# Altium schematic sheet PIC.SchDoc
size A
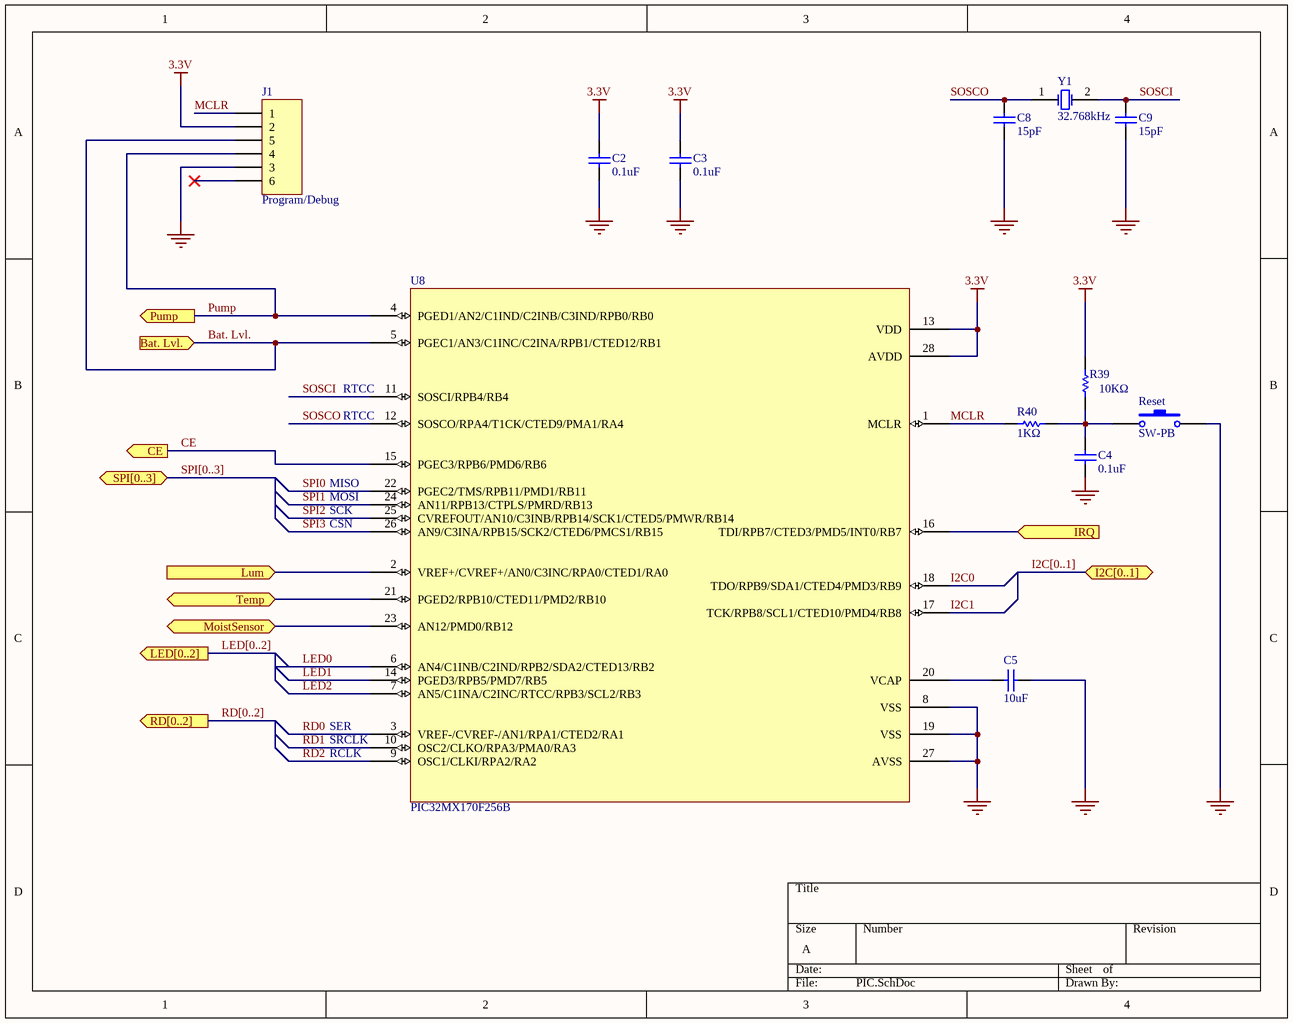
[diagram p0: PIC.SchDoc]

## Parts
C2  0.1uF  [C0603]
C3  0.1uF  [C0603]
C4  0.1uF  [C0603]
C5  10uF  [C0603]
C8  15pF  [C0603]
C9  15pF  [C0603]
J1  Program/Debug  [HDR1X6]
R39  10KΩ  [R0603]
R40  1KΩ  [R0603]
Reset  SW-PB  [Reset]
U8  PIC32MX170F256B  [PIC32MX170F256B]
Y1  32.768kHz  [XTAL]

## Ports
Bat. Lvl. (in), CE (out), I2C[0..1] (bidir), IRQ (in), LED[0..2] (out), Lum (in), MoistSensor (bidir), Pump (out), RD[0..2] (out), SPI[0..3] (bidir), Temp (bidir)

## Nets
3.3V: C2.2 C3.2 J1.2 R39.2 U8.13(VDD) U8.28(AVDD)
GND: C2.1 C3.1 C4.1 C5.2 C8.1 C9.1 J1.3 Reset.2 U8.8(VSS) U8.19(VSS) U8.27(AVSS)
Bat. Lvl.: J1.5 U8.5(PGEC1/AN3/C1INC/C2INA/RPB1/CTED12/RB1) ; port Bat. Lvl.
CE: U8.15(PGEC3/RPB6/PMD6/RB6) ; port CE
I2C0: U8.18(TDO/RPB9/SDA1/CTED4/PMD3/RB9)
I2C1: U8.17(TCK/RPB8/SCL1/CTED10/PMD4/RB8)
IRQ: U8.16(TDI/RPB7/CTED3/PMD5/INT0/RB7) ; port IRQ
LED0: U8.6(AN4/C1INB/C2IND/RPB2/SDA2/CTED13/RB2)
LED1: U8.14(PGED3/RPB5/PMD7/RB5)
LED2: U8.7(AN5/C1INA/C2INC/RTCC/RPB3/SCL2/RB3)
Lum: U8.2(VREF+/CVREF+/AN0/C3INC/RPA0/CTED1/RA0) ; port Lum
MCLR: J1.1 R40.2 U8.1(MCLR)
MoistSensor: U8.23(AN12/PMD0/RB12) ; port MoistSensor
Pump: J1.4 U8.4(PGED1/AN2/C1IND/C2INB/C3IND/RPB0/RB0) ; port Pump
RD0: U8.3(VREF-/CVREF-/AN1/RPA1/CTED2/RA1)
RD1: U8.10(OSC2/CLKO/RPA3/PMA0/RA3)
RD2: U8.9(OSC1/CLKI/RPA2/RA2)
SOSCI: C9.2 U8.11(SOSCI/RPB4/RB4) Y1.2(OSC2)
SOSCO: C8.2 U8.12(SOSCO/RPA4/T1CK/CTED9/PMA1/RA4) Y1.1(OSC1)
SPI0: U8.22(PGEC2/TMS/RPB11/PMD1/RB11)
SPI1: U8.24(AN11/RPB13/CTPLS/PMRD/RB13)
SPI2: U8.25(CVREFOUT/AN10/C3INB/RPB14/SCK1/CTED5/PMWR/RB14)
SPI3: U8.26(AN9/C3INA/RPB15/SCK2/CTED6/PMCS1/RB15)
Temp: U8.21(PGED2/RPB10/CTED11/PMD2/RB10) ; port Temp
NetC4_2: C4.2 R39.1 R40.1 Reset.1
NetC5_1: C5.1 U8.20(VCAP)

Not connected (* = marked no-connect by the designer): J1 6*

## Buses and harness runs
bus I2C[0..1] = port I2C[0..1]
bus LED[0..2] = port LED[0..2]
bus RD[0..2] = port RD[0..2]
bus SPI[0..3] = port SPI[0..3]

## Notes on the sheet
- (near U8) RTCC
- MISO
- MOSI
- SCK
- CSN
- SER
- RCLK
- (near U8) SRCLK

## Library data of the parts
C2-C4 = Cap: Capacitor; Manufacturer: MURATA; Ref.Manufacturer: GRM188R71H104KA93; Value: 100pF; Published: 8-Jun-2000; LatestRevisionDate: 17-Jul-2002; LatestRevisionNote: Re-released for DXP Platform.; PackageReference: RAD-0.3; Publisher: Altium Limited; PackageDescription: Radial Cap, Thru-Hole; 2 Leads; 0.3 in Pin Spacing; Ref.Farnell: 8820023; Supplier: Farnell
C5 = Cap: Capacitor; Manufacturer: MURATA; Ref.Manufacturer: GRM188D71A106MA73; Value: 100pF; Published: 8-Jun-2000; LatestRevisionDate: 17-Jul-2002; LatestRevisionNote: Re-released for DXP Platform.; PackageReference: RAD-0.3; Publisher: Altium Limited; PackageDescription: Radial Cap, Thru-Hole; 2 Leads; 0.3 in Pin Spacing; Ref.Farnell: 2611920; Supplier: Farnell
C8 C9 = Cap: Capacitor; Manufacturer: MURATA; Ref.Manufacturer: GRM1885C1H150JA01; Value: 27pF; Published: 8-Jun-2000; LatestRevisionDate: 17-Jul-2002; LatestRevisionNote: Re-released for DXP Platform.; PackageReference: RAD-0.3; Publisher: Altium Limited; PackageDescription: Radial Cap, Thru-Hole; 2 Leads; 0.3 in Pin Spacing; Ref.Farnell: 8819823; Supplier: Farnell
J1 = Header 6: Header, 6-Pin; LatestRevisionDate: 17-Jul-2002; LatestRevisionNote: Re-released for DXP Platform.; Publisher: Altium Limited; Supplier: Farnell
R39 = Res1: Resistor; Manufacturer: MULTICOMP; Ref.Manufacturer: MC0063W0603110K; Value: 1K; Published: 8-Jun-2000; LatestRevisionDate: 17-Jul-2002; LatestRevisionNote: Re-released for DXP Platform.; PackageReference: AXIAL-0.3; Publisher: Altium Limited; PackageDescription: Axial Device, Thru-Hole; 2 Leads; 0.3 in Pin Spacing; Ref.Farnell: 9330399; Supplier: Farnell
R40 = Res1: Resistor; Manufacturer: MULTICOMP; Ref.Manufacturer: MC0063W060311K; Value: 1K; Published: 8-Jun-2000; LatestRevisionDate: 17-Jul-2002; LatestRevisionNote: Re-released for DXP Platform.; PackageReference: AXIAL-0.3; Publisher: Altium Limited; PackageDescription: Axial Device, Thru-Hole; 2 Leads; 0.3 in Pin Spacing; Ref.Farnell: 9330380; Supplier: Farnell
Reset = SW-PB: Switch; Manufacturer: ALCOSWITCH - TE CONNECTIVITY; Ref.Manufacturer: 1437566-3; Published: 24-Mar-1999; LatestRevisionDate: 17-Jul-2002; LatestRevisionNote: Re-released for DXP Platform.; PackageReference: SPST-2; Publisher: Altium Limited; PackageDescription: Switch; 2 Leads; Ref.Farnell: 2468741; Supplier: Farnell
U8 = PIC32MX170F256B: Pic; Manufacturer: MICROCHIP; Ref.Manufacturer: PIC32MX170F256B-I/SO; Ref.Farnell: 2449077; Supplier: Farnell
Y1 = XTAL: Crystal Oscillator; Manufacturer: ABRACON; Ref.Manufacturer: AB38T-32.768KHZ; Published: 8-Jun-2000; LatestRevisionDate: 17-Jul-2002; LatestRevisionNote: Re-released for DXP Platform.; PackageReference: R38; Publisher: Altium Limited; PackageDescription: Crystal, Thru-Hole; 2 Leads; Body 3.1 x 8.2 mm (Dia.xH); Ref.Farnell: 1611828; Supplier: Farnell